# Altium schematic sheet Gate_Strobe.SchDoc: FIT_PM12 board
size 420 x 297 mm; CheckedBy: G.Kasprowicz; Author: INR Moscow; CompanyName: WUT ISE; DrawnBy: M.Podgórski; Organization: WUT ISE; Address1: PW ISE; Address2: Nowowiejska 15/19 00-665 Warsaw; Address3: gkasprow@gmail.com; DocumentNumber: 5; Revision: 2; SheetNumber: 9; SheetTotal: 21; ModifiedBy: -; CheckedDate: -; Title2: INT gate strobe; DivGrp: WUT ISE; Designer: INR RAS; ModifiedDate: -; ProjectName: Sensor Box
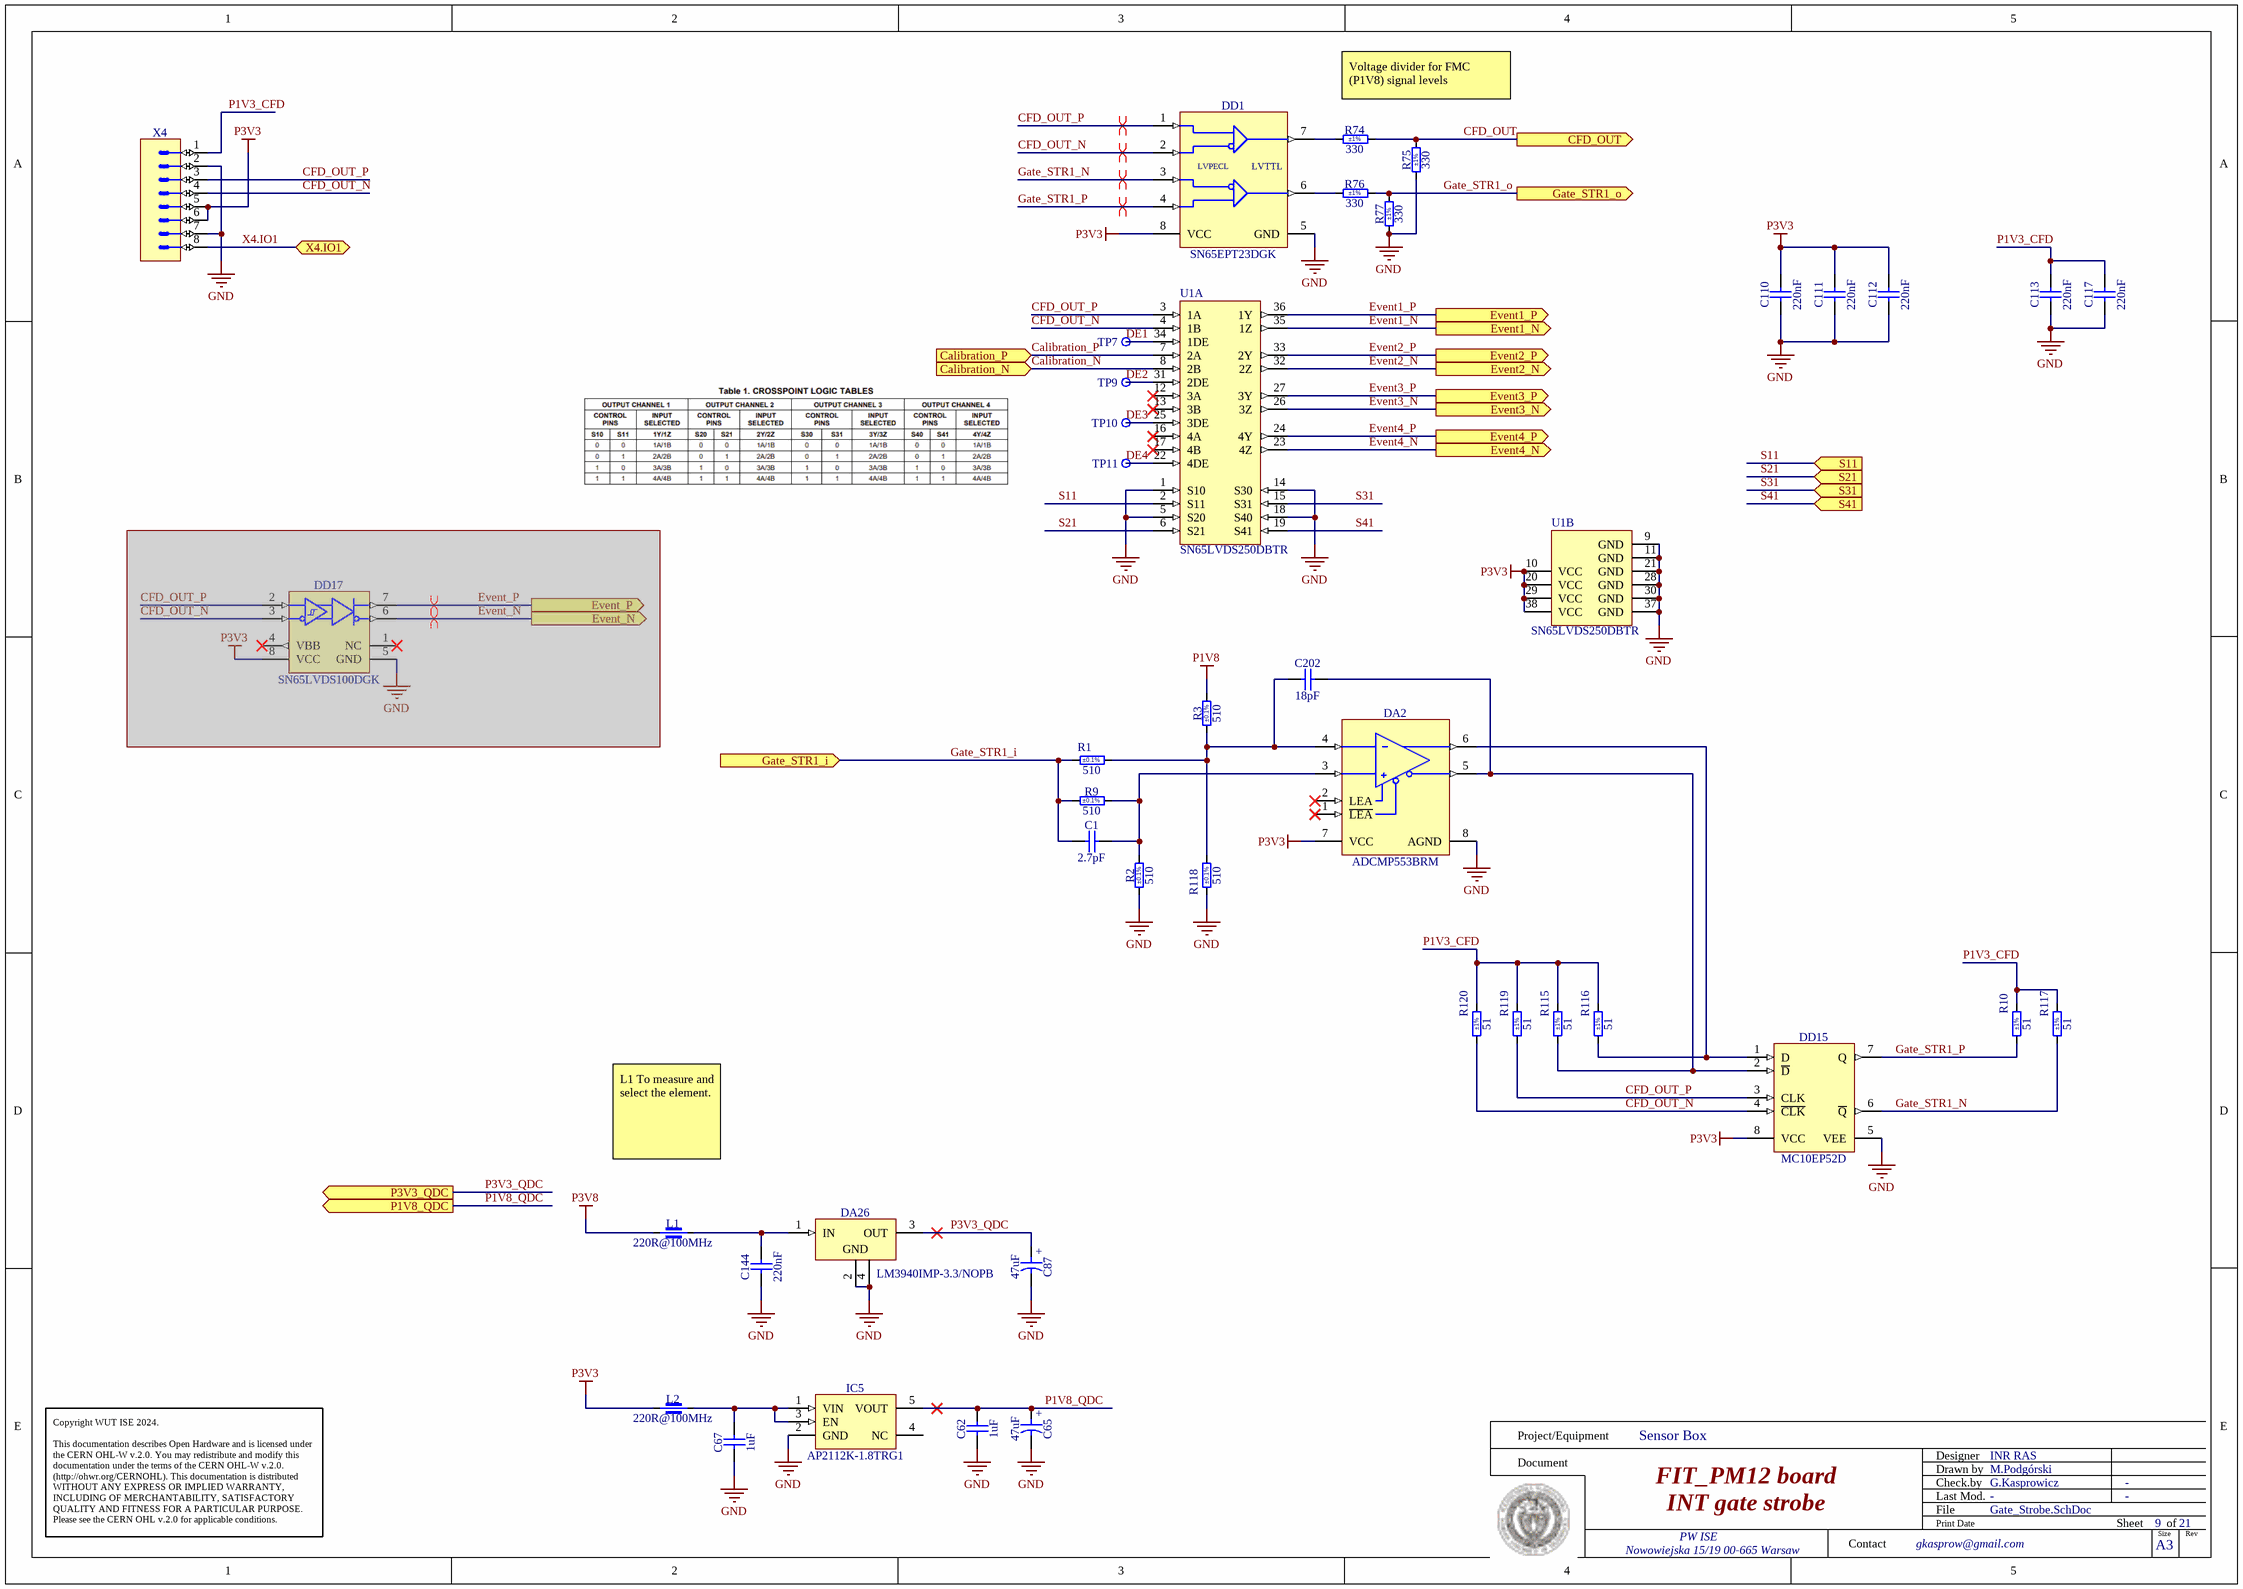
[diagram p0: Gate_Strobe.SchDoc]

## Parts
C1  2.7pF  [CAPC2012X135N]
C62  1uF  [CAPC2012X140N]
C65  47uF  [CAPAE530X610N]
C67  1uF  [CAPC2012X140N]
C87  47uF  [CAPAE530X610N]
C110  220nF  [CAPC1005X55N]
C111  220nF  [CAPC1005X55N]
C112  220nF  [CAPC1005X55N]
C113  220nF  [CAPC1005X55N]
C117  220nF  [CAPC1005X55N]
C144  220nF  [CAPC2012X135N]
C202  18pF  [CAPC2012X88N]
DA2  ADCMP553BRM  [SOP65P490X110-8N]
DA26  LM3940IMP-3.3/NOPB  [SOT230P700X180-4N]
DD1  SN65EPT23DGK  [SOP65P490X110-8N]
DD15  MC10EP52D  [SOIC127P600X175-8N]
DD17  SN65LVDS100DGK  [SOP65P490X110-8N]  (masked out: inside a compile mask, not in the netlist)
IC5  AP2112K-1.8TRG1  [SOT95P285X140-5N]
L1  220R@100MHz  [INDC2012X105N]
L2  220R@100MHz  [INDC2012X105N]
R1  510  Tolerance: ±0.1%  [RESC2012X60N]
R2  510  Tolerance: ±0.1%  [RESC2012X60N]
R3  510  Tolerance: ±0.1%  [RESC2012X60N]
R9  510  Tolerance: ±0.1%  [RESC2012X60N]
R10  51  Tolerance: ±1%  [RESC2012X60N]
R74  330  Tolerance: ±1%  [RESC1005X40N]
R75  330  Tolerance: ±1%  [RESC1005X40N]
R76  330  Tolerance: ±1%  [RESC1005X40N]
R77  330  Tolerance: ±1%  [RESC1005X40N]
R115  51  Tolerance: ±1%  [RESC2012X60N]
R116  51  Tolerance: ±1%  [RESC2012X60N]
R117  51  Tolerance: ±1%  [RESC2012X60N]
R118  510  Tolerance: ±0.1%  [RESC2012X60N]
R119  51  Tolerance: ±1%  [RESC2012X60N]
R120  51  Tolerance: ±1%  [RESC2012X60N]
TP7  SMD Pad  [C60]  (value not drawn)
TP9  SMD Pad  [C60]  (value not drawn)
TP10  SMD Pad  [C60]  (value not drawn)
TP11  SMD Pad  [C60]  (value not drawn)
U1  SN65LVDS250DBTR  [DBT0038A_M]  (parts A,B of 2)
X4  Header 8  [SAMTEC_DW-08-09-L-S-470]  (value not drawn)

## Ports
Calibration_N (in), Calibration_P (in), CFD_OUT (out), Event1_N (out), Event1_P (out), Event2_N (out), Event2_P (out), Event3_N (out), Event3_P (out), Event4_N (out), Event4_P (out), Event_N (out), Event_P (out), Gate_STR1_i (in), Gate_STR1_o (out), P1V8_QDC (out), P3V3_QDC (out), S11 (in), S21 (in), S31 (in), S41 (in), X4.IO1 (bidir)

## Nets
GND: C62.1 C65.2 C67.1 C87.2 C110.1 C111.1 C112.1 C113.1 C117.1 C144.1 DA2.8(AGND) DA26.2(GND) DA26.4(GND) DD1.5(GND) DD15.5(VEE) IC5.2(GND) R2.1 R75.1 R77.1 R118.1 U1.1(S10) U1.5(S20) U1.9(GND) U1.11(GND) U1.14(S30) U1.18(S40) U1.21(GND) U1.28(GND) U1.30(GND) U1.37(GND) X4.2 X4.7
P1V8: R3.2
P3V3: C110.2 C111.2 C112.2 DA2.7(VCC) DD1.8(VCC) DD15.8(VCC) L2.1 U1.10(VCC) U1.20(VCC) U1.29(VCC) U1.38(VCC) X4.5 X4.6
P3V8: L1.1
Calibration_N: U1.8(2B) ; port Calibration_N
Calibration_P: U1.7(2A) ; port Calibration_P
CFD_OUT: R74.2 R75.2 ; port CFD_OUT
CFD_OUT_N: DD1.2(~{D0}) DD15.4(~{CLK}) R120.1 U1.4(1B) X4.4
CFD_OUT_P: DD1.1(D0) DD15.3(CLK) R119.1 U1.3(1A) X4.3
DE1: TP7.1 U1.34(1DE)
DE2: TP9.1 U1.31(2DE)
DE3: TP10.1 U1.25(3DE)
DE4: TP11.1 U1.22(4DE)
Event1_N: U1.35(1Z) ; port Event1_N
Event1_P: U1.36(1Y) ; port Event1_P
Event2_N: U1.32(2Z) ; port Event2_N
Event2_P: U1.33(2Y) ; port Event2_P
Event3_N: U1.26(3Z) ; port Event3_N
Event3_P: U1.27(3Y) ; port Event3_P
Event4_N: U1.23(4Z) ; port Event4_N
Event4_P: U1.24(4Y) ; port Event4_P
Gate_STR1_i: C1.1 R1.1 R9.1 ; port Gate_STR1_i
Gate_STR1_N: DD1.3(~{D1}) DD15.6(~{Q}) R117.1
Gate_STR1_o: R76.2 R77.2 ; port Gate_STR1_o
Gate_STR1_P: DD1.4(D1) DD15.7(Q) R10.1
P1V3_CFD: C113.2 C117.2 R10.2 R115.2 R116.2 R117.2 R119.2 R120.2 X4.1
P1V8_QDC: C62.2 C65.1 IC5.5(VOUT) ; port P1V8_QDC
P3V3_QDC: C87.1 DA26.3(OUT) ; port P3V3_QDC
S11: U1.2(S11) ; port S11
S21: U1.6(S21) ; port S21
S31: U1.15(S31) ; port S31
S41: U1.19(S41) ; port S41
X4.IO1: X4.8 ; port X4.IO1
NetC1_2: C1.2 DA2.3(+INA) R2.2 R9.2
NetC67_2: C67.2 IC5.1(VIN) IC5.3(EN) L2.2
NetC144_2: C144.2 DA26.1(IN) L1.2
NetC202_1: C202.1 DA2.4(-INA) R1.2 R3.1 R118.2
NetC202_2: C202.2 DA2.5(~{QA}) DD15.2(~{D}) R115.1
NetDA2_6: DA2.6(QA) DD15.1(D) R116.1
NetDD1_6: DD1.6(Q1) R76.1
NetDD1_7: DD1.7(Q0) R74.1

Not connected (* = marked no-connect by the designer): DA2 1(~{LEA})* 2(LEA)*; IC5 4(NC); U1 12(3A)* 13(3B)* 16(4A)* 17(4B)*

## Layout directives
differential pair; differential pair class D100: (no net found under the mark), CFD_OUT_N, CFD_OUT_P, Gate_STR1_N, Gate_STR1_P

## Notes on the sheet
- Voltage divider for FMC (P1V8) signal levels
- L1 To measure and select the element.
- Project/Equipment
- Document
- Designer
- Drawn by
- Check.by
- Copyright WUT ISE 2024.
  This documentation describes Open Hardware and is licensed under the CERN OHL-W v.2.0. You may redistribute and modify this documentation under the terms of the CERN OHL-W v.2.0. (http://ohwr.org/CERNOHL). This documentation is distributed WITHOUT ANY EXPRESS OR IMPLIED WARRANTY, INCLUDING OF MERCHANTABILITY, SATISFACTORY QUALITY AND FITNESS FOR A PARTICULAR PURPOSE. Please see the CERN OHL v.2.0 for applicable conditions.
- Contact
- File
- Last Mod.
- Print Date
- Sheet
- Size
- A3
- of
- Rev
- (in symbol CAE530-610_47UF_16V_20%) +
- (in symbol SN65EPT23DGK) LVPECL; LVTTL

## Library data of the parts
C1 = CC0805_2.7PF_250V_0.05PF_NP0: Non-polarised capacitor; Part Description: SMD Multilayer Chip Ceramic Capacitor; Manufacturer: GENERIC; Manufacturer1 Part Number: 600F2R7AT250XT; Voltage: 50V; TC: C0G/NP0; Tolerance: ±0.05pF; Part Number: CC0805_2.7PF_250V_0.05PF_NP0; Component Kind: Standard; Component Type: Standard; Pin Count: 2; Value: 2.7pF; Status: None; Manufacturer Part Number: CC0805_2.7PF_250V_0.05PF_NP0; Case: 0805; Mounted: Yes; Socket: No; SMD: Yes; Sense: No; Manufacturer1 Example: AVX; Manufacturer1 ComponentHeight: 1.30mm; HelpURL: \\cern.ch\dfs\Applications\Altium\Datasheets\CC0805_NP0_AVX(MLC).pdf; Author: CERN DEM HF; CreateDate: 07.05.2024; LatestRevisionDate: 07.05.2024
C62 C67 = CC0805_1UF_25V_10%_X7R: Non-polarised capacitor; Part Description: SMD Multilayer Chip Ceramic Capacitor; Manufacturer: GENERIC; Manufacturer1 Part Number: C0805C105K3RAC; Voltage: 25V; TC: X7R; Tolerance: ±10%; Part Number: CC0805_1UF_25V_10%_X7R; Component Kind: Standard; Component Type: Standard; Pin Count: 2; Value: 1uF; Status: Preferred; Manufacturer Part Number: CC0805_1UF_25V_10%_X7R; Case: 0805; Mounted: Yes; Socket: No; SMD: Yes; Sense: No; Manufacturer1 Example: KEMET; Manufacturer1 ComponentHeight: 1.4mm; HelpURL: \\cern.ch\dfs\Applications\Altium\Datasheets\CC0805_X7R_KEMET.pdf; Author: CERN DEM JLC; CreateDate: 23.03.2009; LatestRevisionDate: 23.03.2009
C65 C87 = CAE530-610_47UF_16V_20%: Polarised capacitor; Part Description: Conductive Polymer Hybrid Aluminum Electrolytic Capacitor; Manufacturer: CHEMI-CON; Manufacturer Part Number: HHXD160ARA470ME61G; Voltage: 16V; Tolerance: ±20%; Part Number: CAE530-610_47UF_16V_20%; Component Kind: Standard; Component Type: Standard; Pin Count: 2; Value: 47uF; Status: Not Recommended; Case: C; Mounted: Yes; Socket: No; SMD: Yes; Sense: No; ComponentHeight: 6.1mm; HelpURL: \\cern.ch\dfs\Applications\Altium\Datasheets\CAE_CHIMI-CON_HXD.pdf; Author: CERN DEM HF; CreateDate: 15.04.2024; LatestRevisionDate: 15.04.2024
C110-C113 C117 = CC0402_220NF_16V_10%_X7R: Non-polarised capacitor; Part Description: SMD Multilayer Chip Ceramic Capacitor; Manufacturer: GENERIC; Manufacturer1 Part Number: C1005X7R1C224K050; Voltage: 16V; TC: X7R; Tolerance: ±10%; Part Number: CC0402_220NF_16V_10%_X7R; Component Kind: Standard; Component Type: Standard; Pin Count: 2; Value: 220nF; Status: Preferred; Manufacturer Part Number: CC0402_220NF_16V_10%_X7R; Case: 0402; Mounted: Yes; Socket: No; SMD: Yes; Sense: No; Manufacturer1 Example: TDK; Manufacturer1 ComponentHeight: 0.55mm; HelpURL: \\cern.ch\dfs\Applications\Altium\Datasheets\CC0402_X7R_TDK_C.pdf; Author: CERN DEM JLC; CreateDate: 25.10.2012; LatestRevisionDate: 25.10.2012
C144 = CC0805_220NF_50V_10%_X7R: Non-polarised capacitor; Part Description: SMD Multilayer Chip Ceramic Capacitor; Manufacturer: GENERIC; Manufacturer1 Part Number: GRM21BR71H224KA01L; Voltage: 50V; TC: X7R; Tolerance: ±10%; Part Number: CC0805_220NF_50V_10%_X7R; Component Kind: Standard; Component Type: Standard; Pin Count: 2; Value: 220nF; Status: Preferred; Manufacturer Part Number: CC0805_220NF_50V_10%_X7R; Case: 0805; Mounted: Yes; Socket: No; SMD: Yes; Sense: No; Manufacturer1 Example: MURATA; Manufacturer1 ComponentHeight: 1.35mm; HelpURL: \\cern.ch\dfs\Applications\Altium\Datasheets\CC0805_X7R_MURATA.pdf; Author: CERN DEM JLC; CreateDate: 03.12.2007; LatestRevisionDate: 03.12.2007
C202 = CC0805_18PF_50V_1%_C0G: Non-polarised capacitor; Part Description: SMD Multilayer Chip Ceramic Capacitor; Manufacturer: GENERIC; Manufacturer1 Part Number: C0805C180F5GACTU; Voltage: 50V; TC: C0G/NP0; Tolerance: ±1%; Part Number: CC0805_18PF_50V_1%_C0G; Component Kind: Standard; Component Type: Standard; Pin Count: 2; Value: 18pF; Status: None; Manufacturer Part Number: CC0805_18PF_50V_1%_C0G; Case: 0805; Mounted: Yes; Socket: No; SMD: Yes; Sense: No; Manufacturer1 Example: KEMET; Manufacturer1 ComponentHeight: 0.88mm; HelpURL: \\cern.ch\dfs\Applications\Altium\Datasheets\CC0805_C0G_KEMET_(Commercial Grade).pdf; Author: CERN DEM JLC; CreateDate: 27.01.2015; LatestRevisionDate: 27.01.2015
DA2 = ADCMP553BRM: Single-Supply, High Speed PECL/LVPECL Comparators; Part Description: Single-Supply, High Speed, PECL/LVPECL Comparators; Manufacturer: ANALOG DEVICES; PressFit: No; Bonding: No; Part Number: ADCMP553BRM; Component Kind: Standard; Component Type: Standard; Device: ADCMP553BRM; PackageDescription: SOP, 0.65mm Pitch; 8 Pin, 3.00mm W X 3.00mm L X 1.10mm H body, IPC Medium Density; Manufacturer Part Number: ADCMP553BRM; Pin Count: 8; Case: MSOP8; Mounted: Yes; Socket: No; SMD: Yes; Sense: No; ComponentHeight: 1.1mm; Author: CERN DEM HF; HelpURL: \\cern.ch\dfs\Applications\Altium\Datasheets\ADCMP553.pdf; CreateDate: 06.05.2024; LatestRevisionDate: 06.05.2024
DA26 = LM3940IMP-3.3/NOPB: 3-Terminal Regulator 1=IN 2=GND 3=OUT 4=GND; Part Description: 1A Low Dropout Regulator for 5V to 3.3V Conversion; Manufacturer: TEXAS INSTRUMENTS; PressFit: No; Bonding: No; Part Number: LM3940IMP-3.3/NOPB; Component Kind: Standard; Component Type: Standard; Device: LM3940IMP-3.3/NOPB; PackageDescription: SOT223, 2.30mm Pitch; 4 Pin, 3.70mm W X 6.70mm L X 1.80mm H body, IPC Medium Density; Manufacturer Part Number: LM3940IMP-3.3; Pin Count: 4; Case: SOT223; Mounted: Yes; Socket: No; SMD: Yes; Sense: No; ComponentHeight: 1.8mm; HelpURL: \\cern.ch\dfs\Applications\Altium\Datasheets\LM3940IMP-3.3-NOPB.pdf; Author: CERN DEM JLC; CreateDate: 28.03.2011; LatestRevisionDate: 01.06.2022
DD1 = SN65EPT23DGK: 5V PECL to TTL Translator; Part Description: 3.3V ECL Differential LVPECL/LVDS to LVTTL/LVCMOS Translator; Manufacturer: TEXAS INSTRUMENTS; PressFit: No; Bonding: No; Part Number: SN65EPT23DGK; Component Kind: Standard; Component Type: Standard; Device: SN65EPT23DGK; PackageDescription: SOP, 0.65mm Pitch; 8 Pin, 3.00mm W X 3.00mm L X 1.10mm H body, IPC Medium Density; Manufacturer Part Number: SN65EPT23DGK; Pin Count: 8; Case: TSSOP8; Mounted: Yes; Socket: No; SMD: Yes; Sense: No; ComponentHeight: 1.1mm; Author: CERN DEM HF; HelpURL: \\cern.ch\dfs\Applications\Altium\Datasheets\SN65EPT23.pdf; CreateDate: 17.05.2024; LatestRevisionDate: 17.05.2024
DD15 = MC10EP52D: 3.3V/5V ECL Differential Data and Clock D Flip-Flop; Manufacturer: ON SEMICONDUCTOR; PressFit: No; Bonding: No; Part Number: MC10EP52D; Component Kind: Standard; Component Type: Standard; Device: MC10EP52D; PackageDescription: SOIC 8, Pitch 1.27mm - Body 4x5mm, IPC Medium Density; Part Description: 3.3V/5V ECL Differential Data and Clock D Flip-Flop; Manufacturer Part Number: MC10EP52D; Pin Count: 8; Case: SOIC8; Mounted: Yes; Socket: No; SMD: Yes; Sense: No; ComponentHeight: 1.75mm; Author: CERN DEM HF; HelpURL: \\cern.ch\dfs\Applications\Altium\Datasheets\MC10EP52D.pdf; CreateDate: 08.05.2024; LatestRevisionDate: 08.05.2024
DD17 = SN65LVDS100DGK: Differential LVDS Translator/Repeater; Part Description: 2Gbps Differential LVDS Translator/Repeater; Manufacturer: TEXAS INSTRUMENTS; PressFit: No; Bonding: No; Part Number: SN65LVDS100DGK; Component Kind: Standard; Component Type: Standard; Device: SN65LVDS100DGK; PackageDescription: SOP, 0.65mm Pitch; 8 Pin, 3.00mm W X 3.00mm L X 1.10mm H body, IPC Medium Density; Manufacturer Part Number: SN65LVDS100DGK; Pin Count: 8; Case: SSOP8; Mounted: Yes; Socket: No; SMD: Yes; Sense: No; ComponentHeight: 1.1mm; Author: CERN DEM JLC; HelpURL: \\cern.ch\dfs\Applications\Altium\Datasheets\SN65LVDS100DGK.pdf; CreateDate: 18.11.2011; LatestRevisionDate: 18.11.2011
IC5 = AP2112K-1.8TRG1: 600mA CMOS Low Dropout Linear Regulator with Enable; Part Description: 1.8V 600mA CMOS Low Dropout Linear Regulator with Enable; Manufacturer: DIODES INCORPORATED; PressFit: No; Bonding: No; Part Number: AP2112K-1.8TRG1; Component Kind: Standard; Component Type: Standard; Device: AP2112K-1.8TRG1; PackageDescription: SOT23, 0.95mm Pitch; 5 Pin, 1.6mm W X 3.0mm L X 1.40mm H body, IPC Medium Density; Manufacturer Part Number: AP2112K-1.8; Pin Count: 5; Case: SOT25; Mounted: Yes; Socket: No; SMD: Yes; Sense: No; ComponentHeight: 1.4mm; HelpURL: \\cern.ch\dfs\Applications\Altium\Datasheets\AP2112K-1.8TRG1.pdf; Author: CERN DEM JLC; CreateDate: 13.06.2018; LatestRevisionDate: 27.06.2022
L1 L2 = IND0805_TDK_MPZ2012S221A: Part Description: SMT Chip Bead for General Power Line (MPZ Series); Manufacturer: TDK; Power: 3A; Resistance: 0.04R; Tolerance: ±25%; Part Number: IND0805_TDK_MPZ2012S221A; Component Kind: Standard; Component Type: Standard; Pin Count: 2; Value: 220R@100MHz; Manufacturer Part Number: MPZ2012S221A; Case: 0805; Mounted: Yes; Socket: No; SMD: Yes; Sense: No; ComponentHeight: 1.05mm; HelpURL: \\cern.ch\dfs\Applications\Altium\Datasheets\IND0805_TDK_MPZ2012.pdf; Author: CERN DEM HF; CreateDate: 04.10.2021; LatestRevisionDate: 04.10.2021
R1-R3 R9 R118 = R0805_510R_0.1%_0.125W_10PPM: Resistor - 0.1%; Part Description: Thin Film Chip Resistor; Manufacturer: GENERIC; Manufacturer1 Part Number: RT0805BRB07510RL; Power: 0.125W; TC: ±10ppm; PressFit: No; Part Number: R0805_510R_0.1%_0.125W_10PPM; Component Kind: Standard; Component Type: Standard; Pin Count: 2; Value: 510; Status: Not Recommended; Manufacturer Part Number: R0805_510R_0.1%_0.125W_10PPM; Case: 0805; Mounted: Yes; Sense: No; Socket: No; SMD: Yes; Manufacturer1 Example: YAGEO PHYCOMP; Manufacturer1 ComponentHeight: 0.6mm; HelpURL: \\cern.ch\dfs\Applications\Altium\Datasheets\R0805_YAGEO_RT.pdf; Author: CERN DEM HF; CreateDate: 11.07.2022; LatestRevisionDate: 11.07.2022
R10 R115-R117 R119 R120 = R0805_51R_1%_0.125W_100PPM: Resistor - 1%; Part Description: General Purpose Thick Film Chip Resistor; Manufacturer: GENERIC; Manufacturer1 Part Number: NRC10F51R0TRF; Power: 0.125W; TC: ±100ppm/°C; PressFit: No; Part Number: R0805_51R_1%_0.125W_100PPM; Component Kind: Standard; Component Type: Standard; Pin Count: 2; Value: 51; Status: Preferred; Manufacturer Part Number: R0805_51R_1%_0.125W_100PPM; Case: 0805; Mounted: Yes; Sense: No; Socket: No; SMD: Yes; Manufacturer1 Example: NIC COMPONENT; Manufacturer1 ComponentHeight: 0.6mm; HelpURL: \\cern.ch\dfs\Applications\Altium\Datasheets\R0805_NIC_NRC.pdf; Author: CERN DEM JLC; CreateDate: 03.12.2007; LatestRevisionDate: 13.03.2008
R74-R77 = R0402_330R_1%_0.0625W_100PPM: Resistor - 1%; Part Description: General Purpose Thick Film Chip Resistor; Manufacturer: GENERIC; Manufacturer1 Part Number: 232270673301L; TC: ±100ppm/°C; PressFit: No; Part Number: R0402_330R_1%_0.0625W_100PPM; Component Kind: Standard; Component Type: Standard; Pin Count: 2; Value: 330; Status: Not Recommended; Power: 0.0625W; Manufacturer Part Number: R0402_330R_1%_0.0625W_100PPM; Case: 0402; Mounted: Yes; Sense: No; Socket: No; SMD: Yes; Manufacturer1 Example: YAGEO PHYCOMP; Manufacturer1 ComponentHeight: 0.4mm; HelpURL: \\cern.ch\dfs\Applications\Altium\Datasheets\R0402_Phycomp_RC0402.pdf; Author: CERN DEM JLC; CreateDate: 03.12.2007; LatestRevisionDate: 17.10.2012
TP7 TP9-TP11 = SMD_PAD_D0.6MM: Test Point; Part Description: 0.6mm Diameter SMD Pad; Mounted: No; Part Number: SMD_PAD_D0.6MM; Component Kind: Standard (No BOM); Component Type: Standard (No BOM); Pin Count: 1; Family: SMD Pad; Socket: No; SMD: Yes; Sense: No; Status: None; ComponentHeight: 0mm; HelpURL: Undefined; Author: CERN DEM HF; CreateDate: 22.11.2023; LatestRevisionDate: 22.11.2023; PackageDescription: 0.6mm Diameter SMD Pad
U1 = CMP-0327-00232-3: 2.0 Gbps 4 x 4 Crosspoint Switch with CML, LVDS, LVPECL Input and LVDS Output, 4 Tx and 4 Rx, -40 to +85 degC, 38-pin TSSOP (DBT), Green (RoHS & no Sb/Br); Part-to-Part Skew(Max)(ps): 300; Manufacturer: Texas Instruments; No. of Tx: 4; SubFamily: Crosspoint-Switch (>1Gbps); Crosspoint-Switch: TRUE; Signaling Rate(Mbps): 2000; ESD HBM(kV): 3; ICC(Max)(mA): 145; Peak-to-Peak Jitter(Max)(ps): 110; ComponentLink1URL: http://www.ti.com/; Mounting Technology: Surface Mount; ComponentLink3Description: URL Link1; ComponentLink2URL: http://www.ti.com/general/docs/lit/getliterature.tsp?genericPartNumber=SN65LVDS250&fileType=pdf; PackageDescription: 38-Pin Plastic Small Outline 0.5 mm Pitch; DatasheetVersion: SLLS594B; ComponentLink3URL: SamplesURL:http://www.ti.com/product/sn65lvds250#samples; Eco-Plan: Green (RoHS & no Sb/Br); Output Signal: LVDS; PartNumber: SN65LVDS250DBTR; Function: Crosspoint; ComponentLink2Description: Datasheet; Input Signal: CML, LVDS, LVPECL; PackageReference: DBT0038A; No. of Rx: 4; ComponentLink1Description: Manufacturer URL; PackageVersion: revI, Mar-2011
X4 = SAMTEC_DW-08-09-L-S-470: Connector 8 Male; Part Description: 8 Contacts, Pitch 2.54mm, Single Row Straight .Flex Stack, Flexible Board Stacker (Stacker Height = 11,938mm); Manufacturer: SAMTEC; PressFit: No; Part Number: SAMTEC_DW-08-09-L-S-470; Component Kind: Standard; Component Type: Standard; Pin Count: 8; Family: Header 8; Mounted: Yes; Socket: No; SMD: No; Sense: No; Status: None; Manufacturer Part Number: DW-08-09-L-S-470; ComponentHeight: 15.75mm; HelpURL: \\cern.ch\dfs\Applications\Altium\Datasheets\SAMTEC_DW.pdf; Author: CERN DEM HF; CreateDate: 06.06.2024; LatestRevisionDate: 06.06.2024